# EAGLE design climate_control (EAGLE 7.4.0)
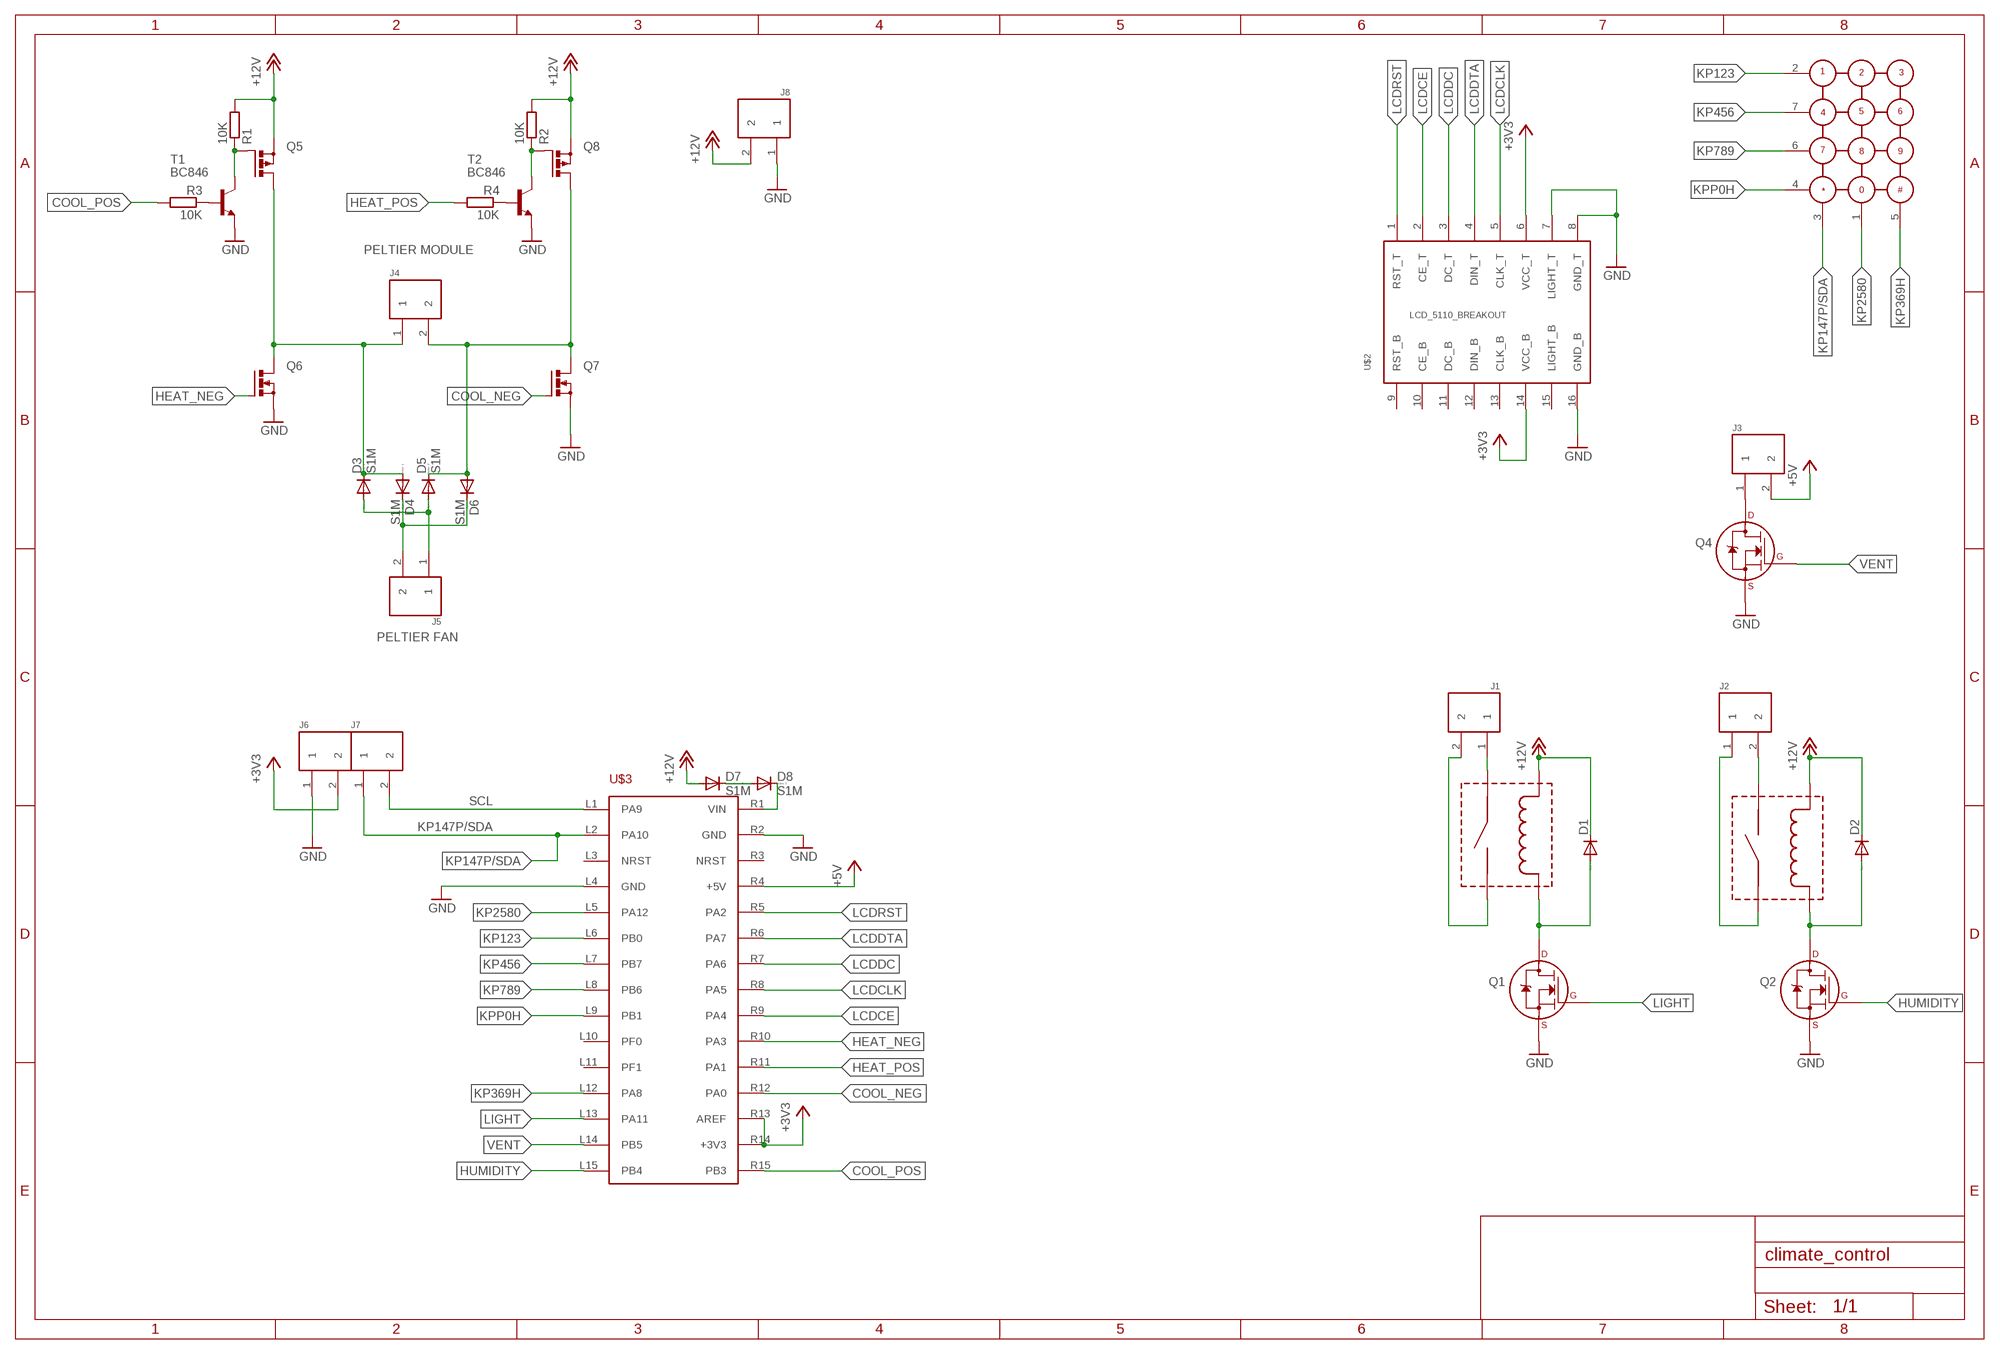
[diagram p0: schematic, sheet 1]

## Parts
D1  DIODE-DO-214AC  [DO-214AC]
D2  DIODE-DO-214AC  [DO-214AC]
D3  S1M  [SMA]
D4  S1M  [SMA]
D5  S1M  [SMA]
D6  S1M  [SMA]
D7  S1M  [SMA]
D8  S1M  [SMA]
J1  TERMINAL_PCB_508_X2  [TERMINAL_PCB_508_PITCH]
J2  TERMINAL_PCB_508_X2  [TERMINAL_PCB_508_PITCH]
J3  TERMINAL_PCB_508_X2  [TERMINAL_PCB_508_PITCH]
J4  TERMINAL_PCB_508_X2  [TERMINAL_PCB_508_PITCH]
J5  TERMINAL_PCB_508_X2  [TERMINAL_PCB_508_PITCH]
J6  TERMINAL_PCB_508_X2  [TERMINAL_PCB_508_PITCH]
J7  TERMINAL_PCB_508_X2  [TERMINAL_PCB_508_PITCH]
J8  TERMINAL_PCB_508_X2  [TERMINAL_PCB_508_PITCH]
Q1  2N7000_TO92  [TO-92]
Q2  2N7000_TO92  [TO-92]
Q4  2N7000_TO92  [TO-92]
Q5  PMOSFET_PTO220BV  [TO220BV]
Q6  PMOSFET_NTO220BV  [TO220BV]
Q7  PMOSFET_NTO220BV  [TO220BV]
Q8  PMOSFET_PTO220BV  [TO220BV]
R1  10K  R-EU_R0805  [R0805]
R2  10K  R-EU_R0805  [R0805]
R3  10K  R-EU_R0805  [R0805]
R4  10K  R-EU_R0805  [R0805]
T1  BC846  [SOT23]
T2  BC846  [SOT23]
U$1  KEYPAD12  [KEYPAD12]
U$2  LCD_5110_BREAKOUT  [LCD_5110_BREAKOUT]
U$3  NUCLEO_F031  [NUCLEO_30]
U$5  RELAY_JZC-33F  [RELAY_JZC-33F]
U$7  RELAY_JZC-33F  [RELAY_JZC-33F]

## Nets
+3V3: J6.2 U$2.6(VCC_T) U$2.14(VCC_B) U$3.R13(AREF) U$3.R14(+3V3)
+5V: J3.2 U$3.R4(+5V)
+12V: D1.C D2.C D7.A J8.2 Q5.S Q8.S R1.2 R2.2 U$5.COIL1 U$7.COIL2
COOL_NEG: Q7.G U$3.R12(PA0)
COOL_POS: R3.2 U$3.R15(PB3)
GND: J6.1 J8.1 Q1.1(S) Q2.1(S) Q4.1(S) Q6.S Q7.S T1.2(E) T2.2(E) U$2.7(LIGHT_T) U$2.8(GND_T) U$2.16(GND_B) U$3.L4(GND) U$3.R2(GND)
HEAT_NEG: Q6.G U$3.R10(PA3)
HEAT_POS: R4.2 U$3.R11(PA1)
HUMIDITY: Q2.2(G) U$3.L15(PB4)
KP123: U$1.2 U$3.L6(PB0)
KP147P/SDA: J7.1 U$1.3(147*) U$3.L2(PA10)
KP369H: U$1.5(369#) U$3.L12(PA8)
KP456: U$1.7 U$3.L7(PB7)
KP789: U$1.6 U$3.L8(PB6)
KP2580: U$1.1 U$3.L5(PA12)
KPP0H: U$1.4(*0#) U$3.L9(PB1)
LCDCE: U$2.2(CE_T) U$3.R9(PA4)
LCDCLK: U$2.5(CLK_T) U$3.R8(PA5)
LCDDC: U$2.3(DC_T) U$3.R7(PA6)
LCDDTA: U$2.4(DIN_T) U$3.R6(PA7)
LCDRST: U$2.1(RST_T) U$3.R5(PA2)
LIGHT: Q1.2(G) U$3.L13(PA11)
N$1: D3.A D5.A J5.1
N$2: D7.C D8.A
N$3: D4.C D6.C J5.2
N$4: D3.C D4.A J4.1 Q5.D Q6.D
N$5: D5.C D6.A J4.2 Q7.D Q8.D
N$6: Q5.G R1.1 T1.3(C)
N$7: Q8.G R2.1 T2.3(C)
N$8: R3.1 T1.1(B)
N$9: R4.1 T2.1(B)
N$10: D8.C U$3.R1(VIN)
N$22: D1.A Q1.3(D) U$5.COIL2
N$23: J1.1 U$5.CONTACT1
N$25: J1.2 U$5.CONTACT2
N$26: D2.A Q2.3(D) U$7.COIL1
N$27: J2.2 U$7.CONTACT2
N$28: J2.1 U$7.CONTACT1
N$36: J3.1 Q4.3(D)
SCL: J7.2 U$3.L1(PA9)
VENT: Q4.2(G) U$3.L14(PB5)
Unconnected: U$2.9(RST_B) U$2.10(CE_B) U$2.11(DC_B) U$2.12(DIN_B) U$2.13(CLK_B) U$2.15(LIGHT_B) U$3.L3(NRST) U$3.L10(PF0) U$3.L11(PF1) U$3.R3(NRST)

## Notes on the sheet
- PELTIER MODULE
- PELTIER FAN

## Library data of the parts
D1 D2 = diode:DIODE-: DIODE
D3-D8 = diode:S1M
J1-J8 = custom:TERMINAL_PCB_508_X2
Q1 Q2 Q4 = transistors:2N700*: 2N7000, 2N7002, NDS7002A N-channel enhancement mode MOSFET
Q5 Q8 = transistor-power:PMOSFET_P: Power MOSFET P-Channel
Q6 Q7 = transistor-power:PMOSFET_N: Power MOSFET N-Channel
R1-R4 = rcl:R-EU_: RESISTOR, European symbol; SPEC: 100mW, +/-1%, 50V
T1 T2 = transistor:BC846: NPN TRANSISTOR
U$1 = KEYPAD12:KEYPAD12
U$2 = LCD5110:LCD_5110_BREAKOUT
U$3 = custom_module:NUCLEO_F031
U$5 U$7 = custom:RELAY_JZC-33F

## Board
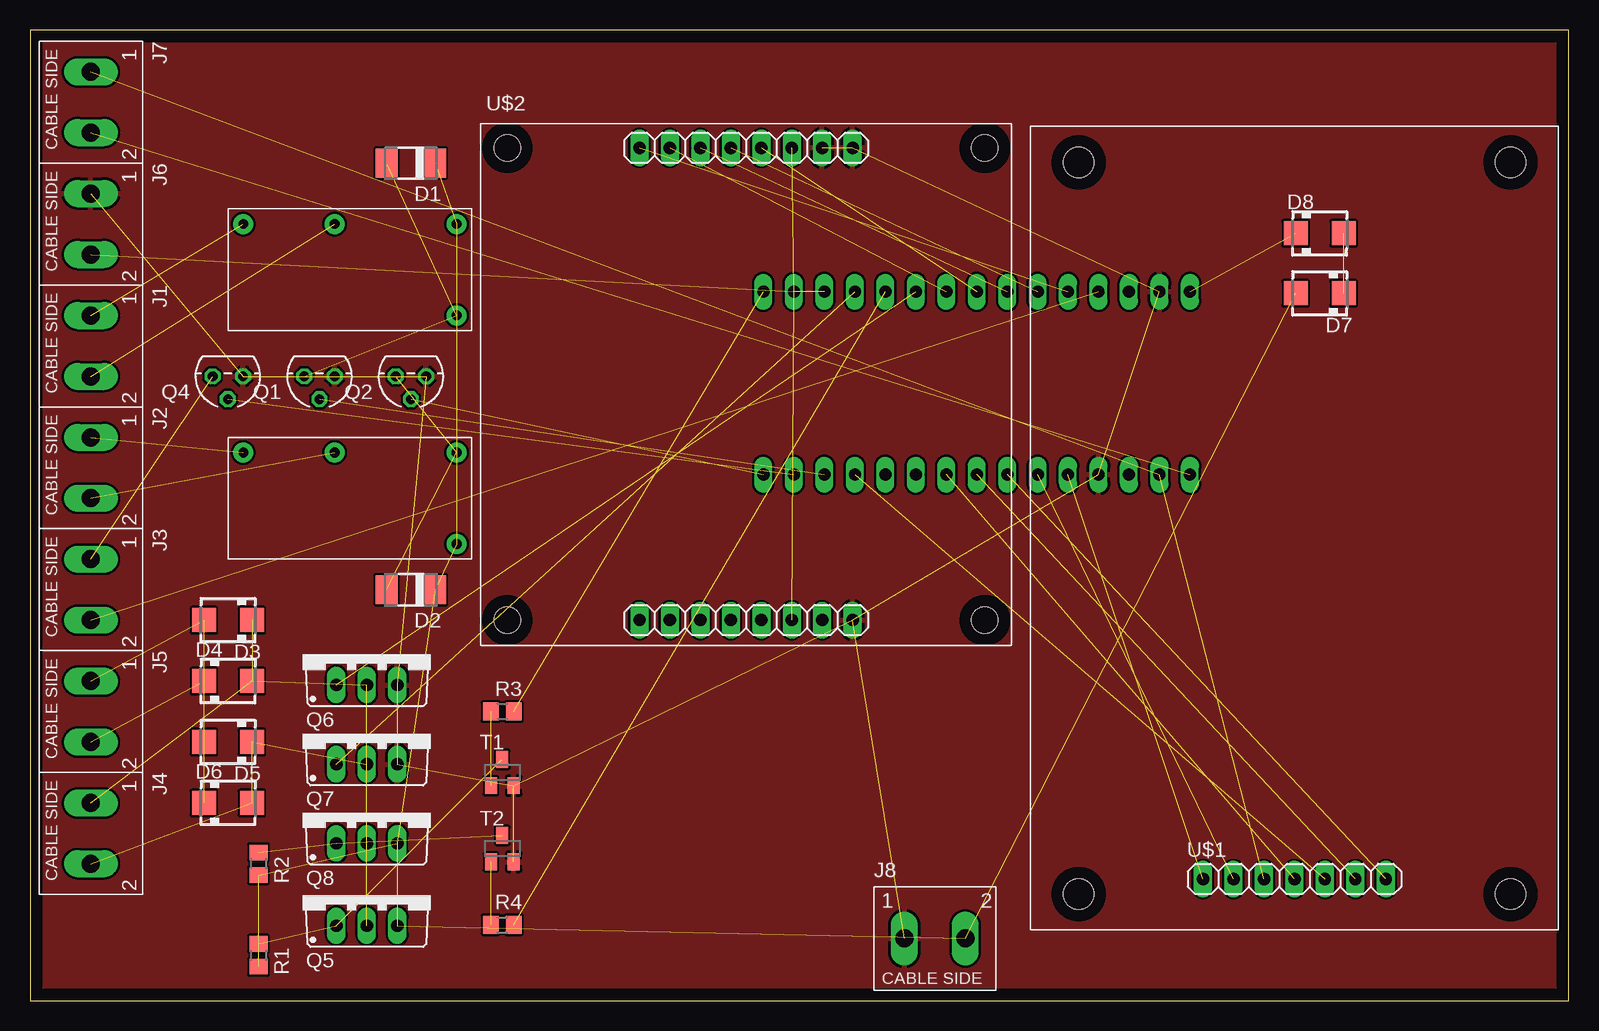
[diagram p1: board, top side]
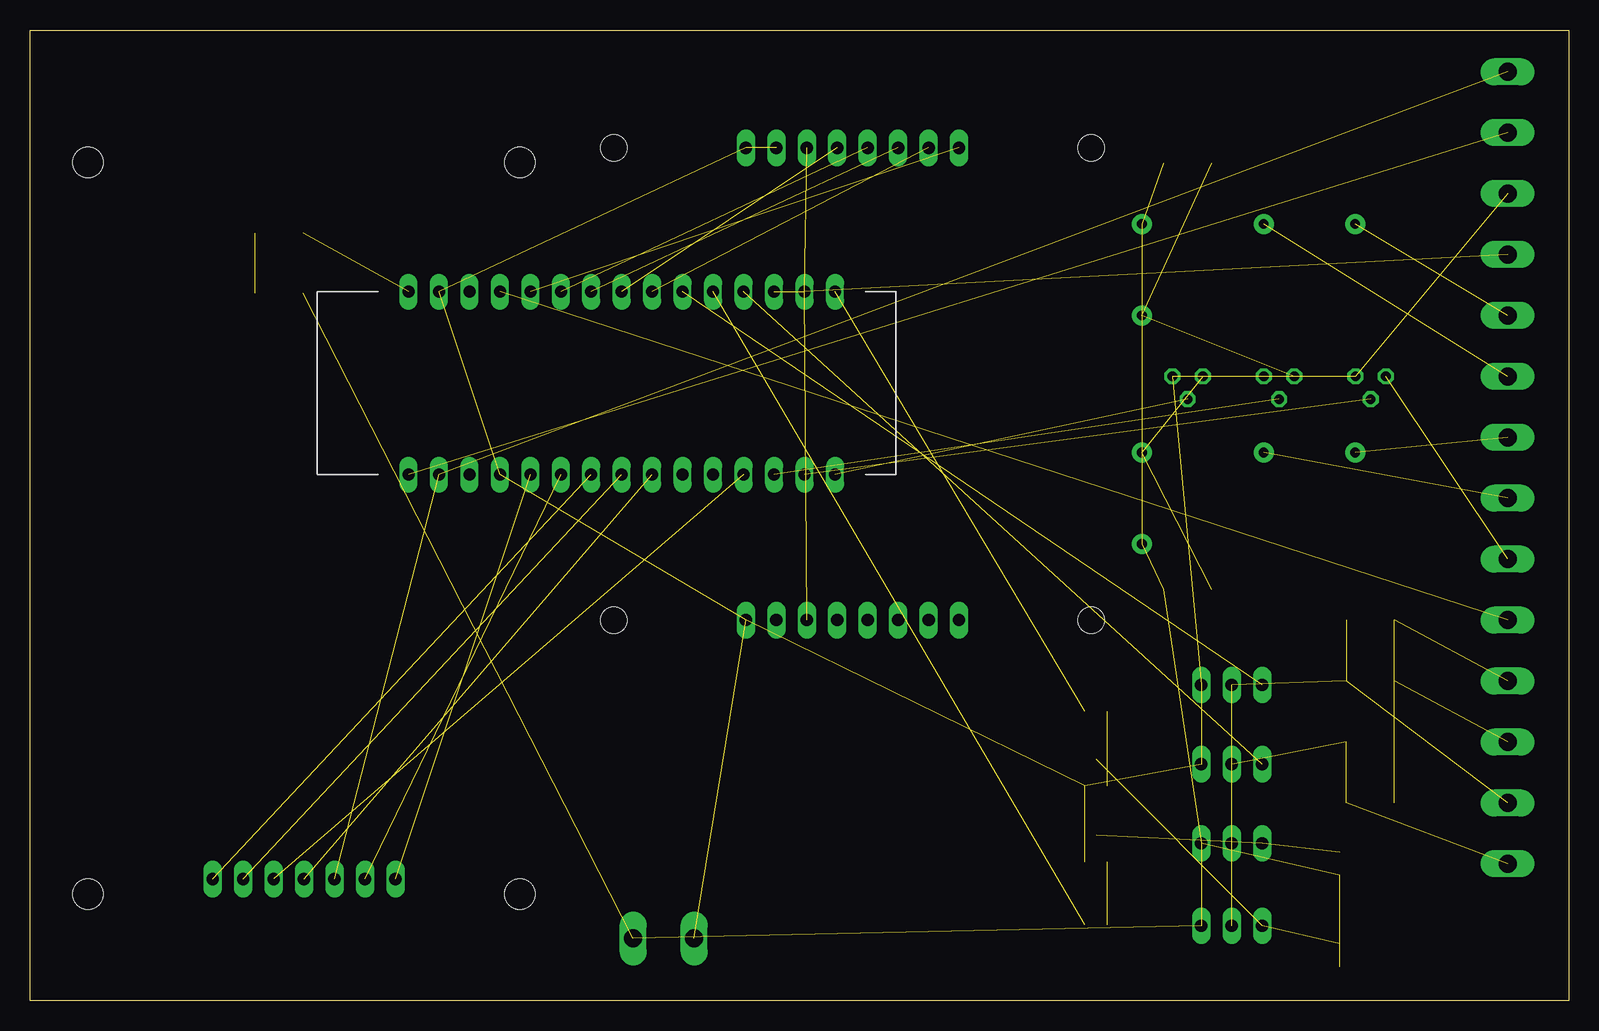
[diagram p2: board, bottom side, seen from below]

Size 128.25 x 80.95 mm. Coordinates in mm from the lower left corner, seen from the top.
Outline: 0,0 128.25,0 128.25,80.95 0,80.95 0,0
Copper layers (1*16): Top 0.035mm / dielectric 1.5mm / Bottom 0.035mm
Design rules "default *": minimum track width 20mil, minimum drill 24mil, track to track 0.2mm, track to pad 0.2mm, pad to pad 0.2mm, via to via 0.2mm, smd to smd 0.2mm, copper to edge 40mil, drill to drill 8mil, minimum pad ring 10mil, minimum via ring 8mil, stop-mask expansion 4mil, vias tented up to drill 0mil, thermal gap 10mil

### Footprints (pad centres in the part's own frame; a part is rotated, then mirrored left to right if it is on the bottom)
DO-214AC = smd 1.8 x 2.4: A 2.025,0; C -2.025,0
SMA = smd 2 x 2: A 2,0; C -2,0
TERMINAL_PCB_508_PITCH = drill 1.5 long: 1 0,0; 2 5.08,0
TO-92 = drill 0.813 octagon: 1 -1.27,0; 2 0,1.905; 3 1.27,0
TO220BV = drill 1.016 long: D 0,-2.54; G -2.54,-2.54; S 2.54,-2.54
R0805 = smd 1.3 x 1.5: 1 -0.95,0; 2 0.95,0
SOT23 = smd 1 x 1.4: 1 -0.95,-1.1; 2 0.95,-1.1; 3 0,1.1
KEYPAD12 = drill 1.016 long: 1 -7.62,0; 2 -5.08,0; 3 -2.54,0; 4 0,0; 5 2.54,0; 6 5.08,0; 7 7.62,0 | hole 2.5: -18,-1.25; 18,-1.25; -18,59.75; 18,59.75
LCD_5110_BREAKOUT = drill 1.016 long: 1 0,0; 2 2.54,0; 3 5.08,0; 4 7.62,0; 5 10.16,0; 6 12.7,0; 7 15.24,0; 8 17.78,0; 9 0,-39.37; 10 2.54,-39.37; 11 5.08,-39.37; 12 7.62,-39.37; 13 10.16,-39.37; 14 12.7,-39.37; 15 15.24,-39.37; 16 17.78,-39.37 | hole 2.2: -11,0; 28.8,0; -11,-39.37; 28.8,-39.37
NUCLEO_30 = drill 1 long: L1 -7.62,12.7; L2 -7.62,10.16; L3 -7.62,7.62; L4 -7.62,5.08; L5 -7.62,2.54; L6 -7.62,0; L7 -7.62,-2.54; L8 -7.62,-5.08; L9 -7.62,-7.62; L10 -7.62,-10.16; L11 -7.62,-12.7; L12 -7.62,-15.24; L13 -7.62,-17.78; L14 -7.62,-20.32; L15 -7.62,-22.86; R1 7.62,12.7; R2 7.62,10.16; R3 7.62,7.62; R4 7.62,5.08; R5 7.62,2.54; R6 7.62,0; R7 7.62,-2.54; R8 7.62,-5.08; R9 7.62,-7.62; R10 7.62,-10.16; R11 7.62,-12.7; R12 7.62,-15.24; R13 7.62,-17.78; R14 7.62,-20.32; R15 7.62,-22.86
RELAY_JZC-33F = drill 0.8 pad 1.676: COIL1 10.16,0; COIL2 10.16,-7.62; CONTACT1 -7.62,0; CONTACT2 0,0

### Placement (x,y rotation side)
D1  31.75,69.85 180 top
D2  31.75,34.29 180 top
D3  16.51,31.75 180 top
D4  16.51,26.67 0 top
D5  16.51,21.59 180 top
D6  16.51,16.51 0 top
D7  107.5,59 180 top
D8  107.5,64 0 top
J1  5.08,57.15 270 top
J2  5.08,46.99 270 top
J3  5.08,36.83 270 top
J4  5.08,16.51 270 top
J5  5.08,26.67 270 top
J6  5.08,67.31 270 top
J7  5.08,77.47 270 top
J8  72.89,5.21 0 top
Q1  24.13,52.07 180 top
Q2  31.75,52.07 180 top
Q4  16.49,52.07 180 top
Q5  28.08,8.81 0 top
Q6  28.08,28.88 0 top
Q7  28.08,22.28 0 top
Q8  28.08,15.68 0 top
R1  19.05,3.81 270 top
R2  19.05,11.43 270 top
R3  39.37,24.13 0 top
R4  39.37,6.35 0 top
T1  39.37,19.05 0 top
T2  39.37,12.7 0 top
U$1  105.41,10.16 0 top
U$2  50.8,71.12 0 top
U$3  84,51.5 90 bottom
U$5  25.4,64.77 0 top
U$7  25.4,45.72 0 top

### Tracks (layer width: path | path; a pad name or v marks a point on that pad's centre or on a via)
+3V3  (4 unrouted)
+5V  (1 unrouted)
+12V  (9 unrouted)
COOL_NEG  (1 unrouted)
COOL_POS  (1 unrouted)
GND  (13 unrouted)
  pour Top: 0.5,80.5 0.5,0.5 128,0.5 128,80.5
HEAT_NEG  (1 unrouted)
HEAT_POS  (1 unrouted)
HUMIDITY  (1 unrouted)
KP123  (1 unrouted)
KP147P/SDA  (2 unrouted)
KP369H  (1 unrouted)
KP456  (1 unrouted)
KP789  (1 unrouted)
KP2580  (1 unrouted)
KPP0H  (1 unrouted)
LCDCE  (1 unrouted)
LCDCLK  (1 unrouted)
LCDDC  (1 unrouted)
LCDDTA  (1 unrouted)
LCDRST  (1 unrouted)
LIGHT  (1 unrouted)
N$1  (2 unrouted)
N$2  (1 unrouted)
N$3  (2 unrouted)
N$4  (4 unrouted)
N$5  (4 unrouted)
N$6  (2 unrouted)
N$7  (2 unrouted)
N$8  (1 unrouted)
N$9  (1 unrouted)
N$10  (1 unrouted)
N$22  (2 unrouted)
N$23  (1 unrouted)
N$25  (1 unrouted)
N$26  (2 unrouted)
N$27  (1 unrouted)
N$28  (1 unrouted)
N$36  (1 unrouted)
SCL  (1 unrouted)
VENT  (1 unrouted)